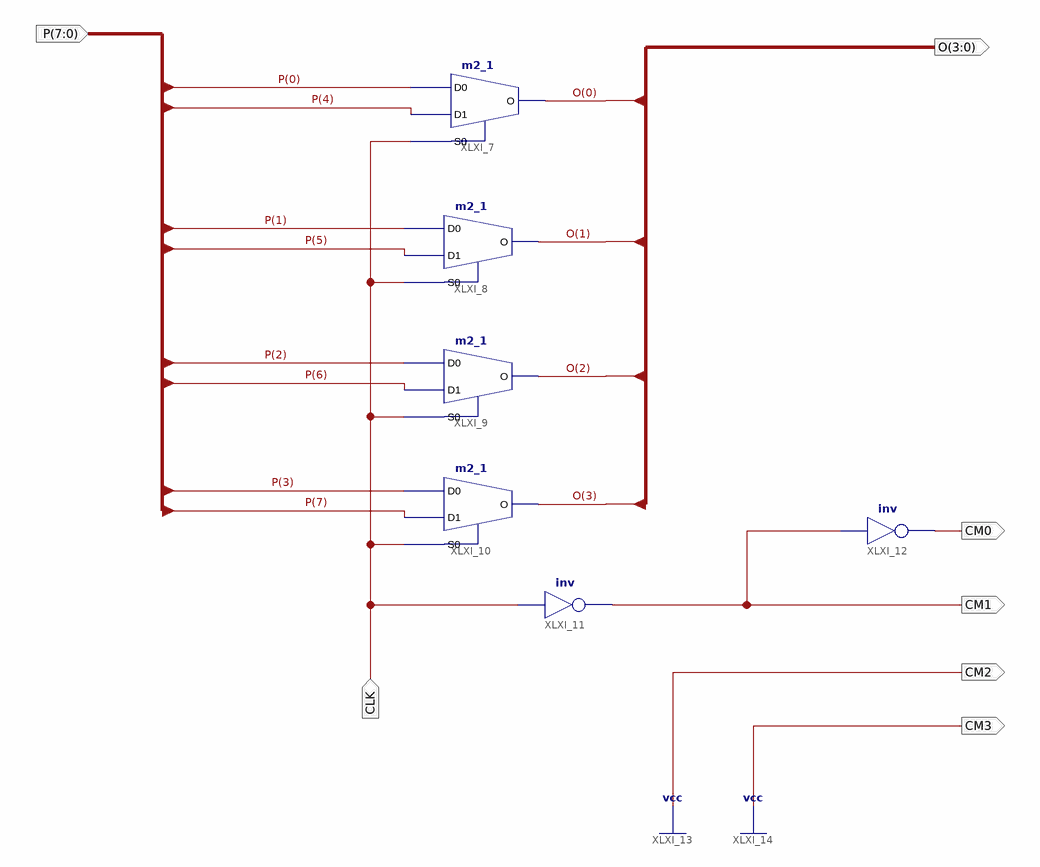
[diagram p0: schematic sheet 1]
// Xilinx ISE schematic MUX8_TO_1.sch (spartan6) as structural Verilog: 6 symbols, 7 ports
module MUX8_TO_1 (
  input  [7:0] P,
  input  CLK,
  output [3:0] O,
  output CM1,
  output CM0,
  output CM2,
  output CM3
);

  m2_1 XLXI_7 (.D0(P[0]), .D1(P[4]), .S0(CLK), .O(O[0]));
  m2_1 XLXI_8 (.D0(P[1]), .D1(P[5]), .S0(CLK), .O(O[1]));
  m2_1 XLXI_9 (.D0(P[2]), .D1(P[6]), .S0(CLK), .O(O[2]));
  m2_1 XLXI_10 (.D0(P[3]), .D1(P[7]), .S0(CLK), .O(O[3]));
  not XLXI_11 (CM1, CLK);
  not XLXI_12 (CM0, CM1);

  assign CM2 = 1'b1;
  assign CM3 = 1'b1;
endmodule
